# EasyEDA Pro project KDP.epro

# Schematic Schematic
Board Name: Development Platform; Create Date: 2026-08-31; Page Name: P1; Project Name: KDP; Schematic Name: Schematic; Update Date: 2026-09-18; Company: EasyEDA.com; Page Size: A4; Version: V1.0
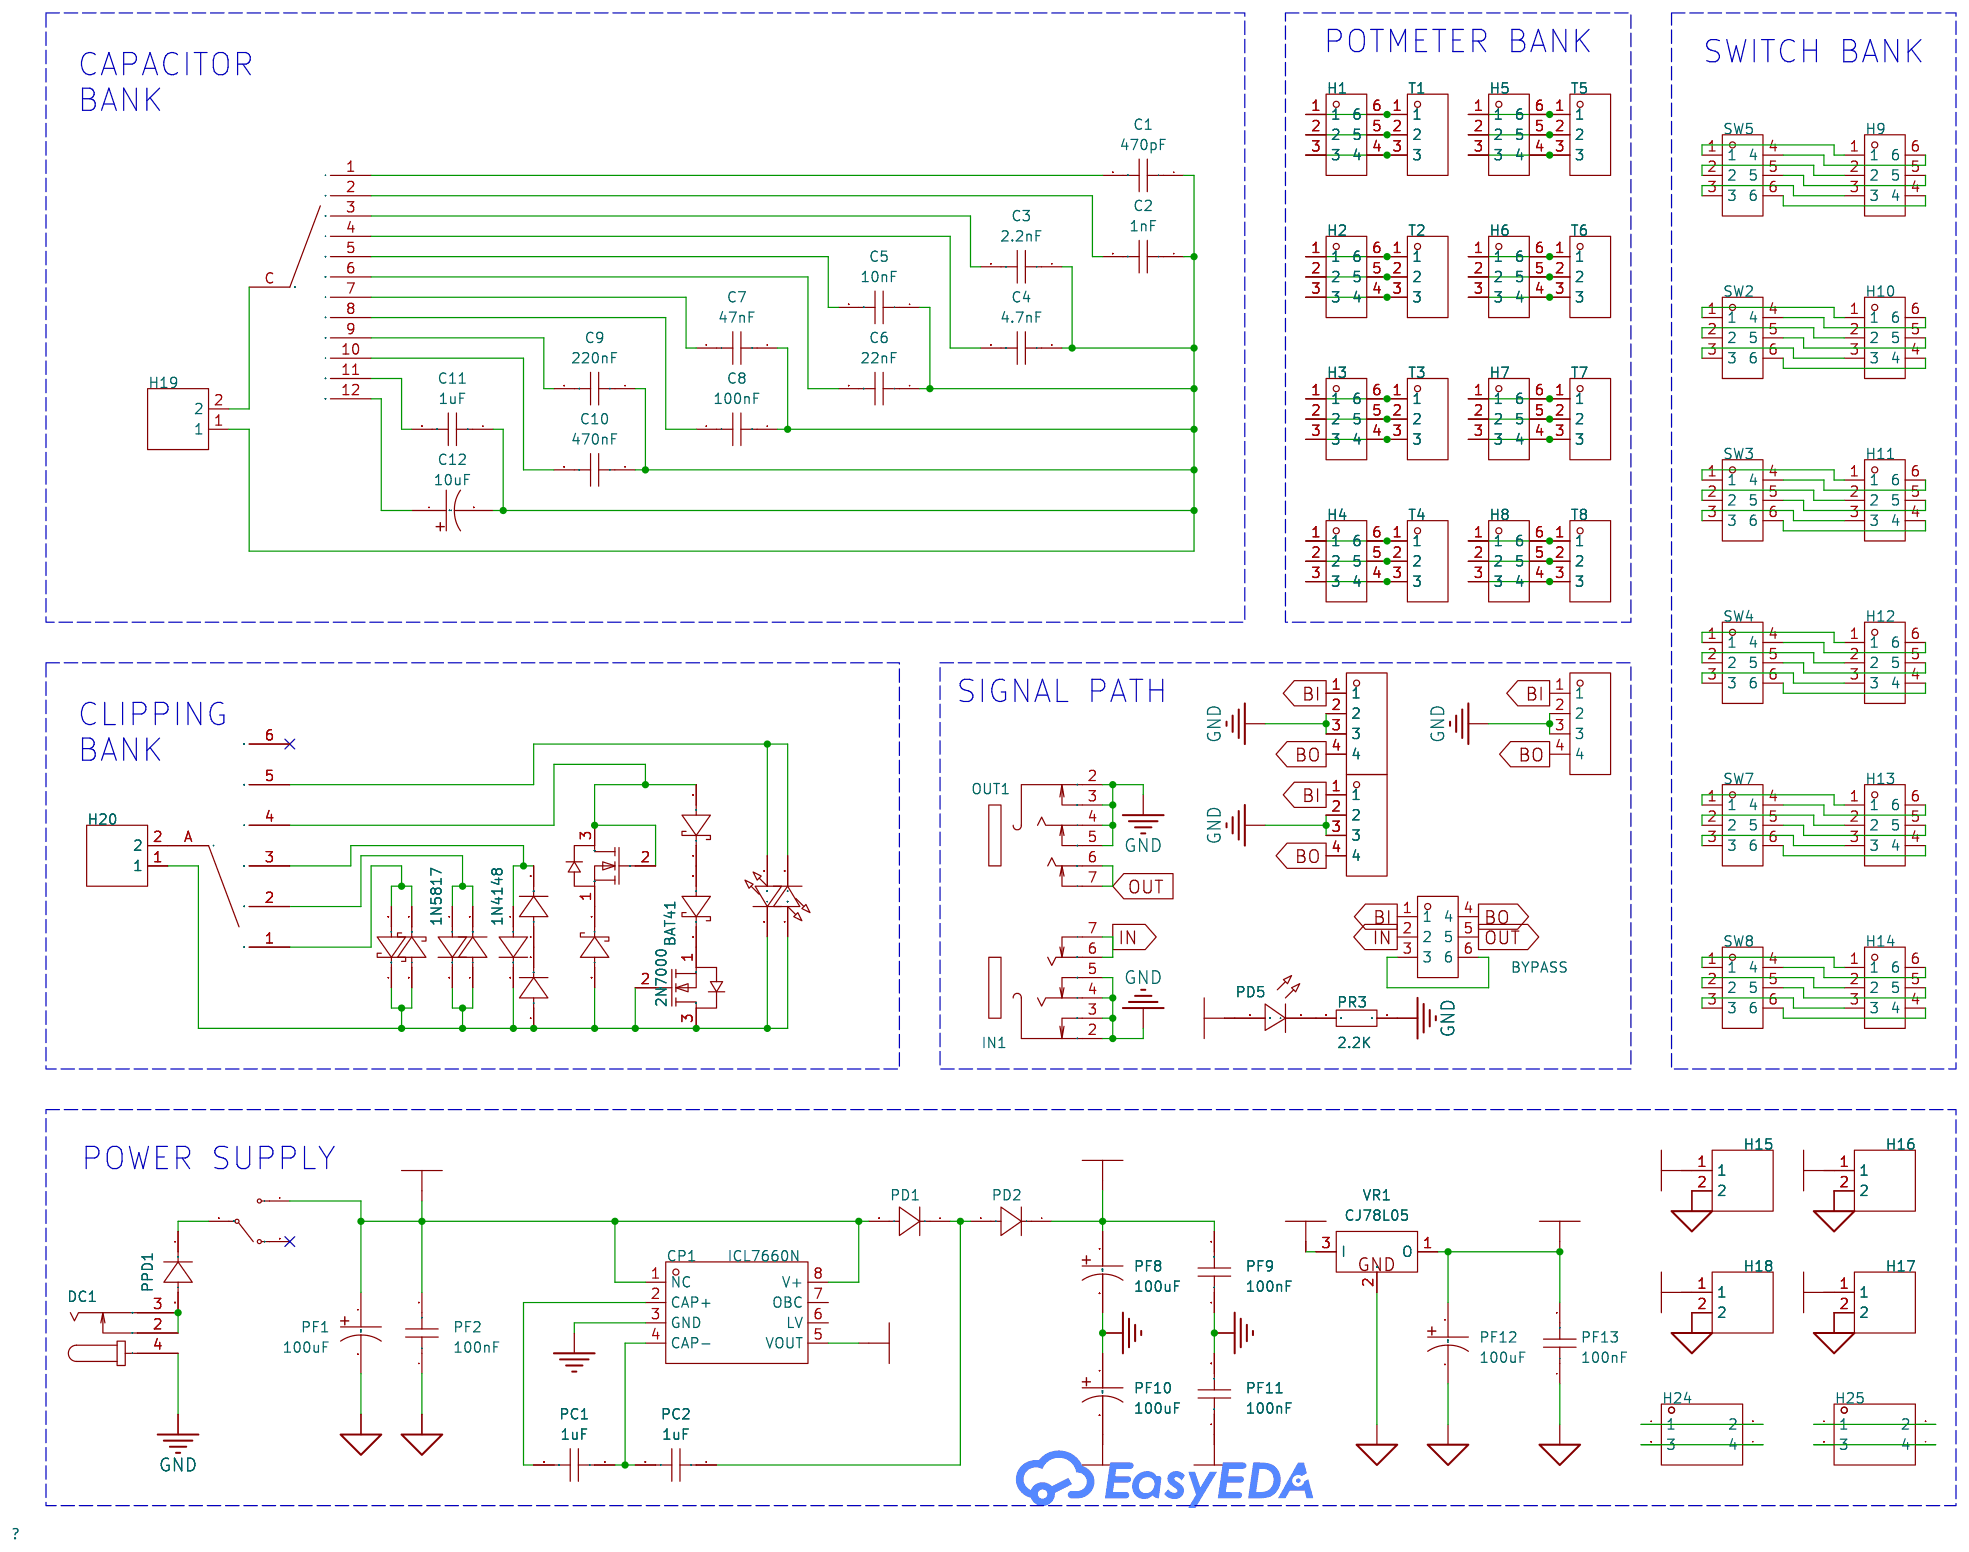
[diagram p0: schematic sheet]

## Parts
BYPASS  ATTACK  [SW-TH_2MD1T1B1M1QES-5]
C1  470pF  [CAP-TH_L4.8-W2.3-P5.08-D0.65]
C2  1nF  [CAP-TH_L4.8-W2.3-P5.08-D0.65]
C3  2.2nF  [CAP-TH_L4.8-W2.3-P5.08-D0.65]
C4  4.7nF  [CAP-TH_L4.8-W2.3-P5.08-D0.65]
C5  10nF  [CAP-TH_L4.8-W2.3-P5.08-D0.65]
C6  22nF  [CAP-TH_L4.8-W2.3-P5.08-D0.65]
C7  47nF  [CAP-TH_L4.8-W2.3-P5.08-D0.65]
C8  100nF  [CAP-TH_L4.8-W2.3-P5.08-D0.65]
C9  220nF  [CAP-TH_L4.8-W2.3-P5.08-D0.65]
C10  470nF  [CAP-TH_L4.8-W2.3-P5.08-D0.65]
C11  1uF  [CAP-TH_L4.8-W2.3-P5.08-D0.65]
C12  10uF  [CAP-TH_BD5.0-P2.00-D0.8-FD]
C_SUB  A30303RNCQ  [SW-TH_15P-BD26.2_A30303RNCQ]
CP1  ICL7660N  [DIP-8_L9.4-W6.4-P2.54-LS9.1-BL]
D1  1N4148  [DO-35_BD2.2-L4.0-D0.50_1N4148]
D2  1N4148  [DO-35_BD2.2-L4.0-D0.50_1N4148]
D3  1N4148  [DO-35_BD2.2-L4.0-D0.50_1N4148]
D4  1N4148  [DO-35_BD2.2-L4.0-D0.50_1N4148]
D5  1N4148  [DO-35_BD2.2-L4.0-D0.50_1N4148]
D6  BAT41  [DO-35_BD1.7-L3.8-P7.8-D0.5-FD]
D7  BAT41  [DO-35_BD1.7-L3.8-P7.8-D0.5-FD]
D8  BAT41  [DO-35_BD1.7-L3.8-P7.8-D0.5-FD]
D-SUB  D-SUB  [SW-TH_15P-BD26.2_A30303RNCQ]
DC1  HX DC005  [DC-IN-TH_HANXIA_HX-DC005-QT]
H1  DS1001-01-06BT1NSF6X-JKB  [DIP-6_L7.6-W10.2-P2.54-LS7.6-BL]
H2  DS1001-01-06BT1NSF6X-JKB  [DIP-6_L7.6-W10.2-P2.54-LS7.6-BL]
H3  DS1001-01-06BT1NSF6X-JKB  [DIP-6_L7.6-W10.2-P2.54-LS7.6-BL]
H4  DS1001-01-06BT1NSF6X-JKB  [DIP-6_L7.6-W10.2-P2.54-LS7.6-BL]
H5  DS1001-01-06BT1NSF6X-JKB  [DIP-6_L7.6-W10.2-P2.54-LS7.6-BL]
H6  DS1001-01-06BT1NSF6X-JKB  [DIP-6_L7.6-W10.2-P2.54-LS7.6-BL]
H7  DS1001-01-06BT1NSF6X-JKB  [DIP-6_L7.6-W10.2-P2.54-LS7.6-BL]
H8  DS1001-01-06BT1NSF6X-JKB  [DIP-6_L7.6-W10.2-P2.54-LS7.6-BL]
H9  DS1001-01-06BT1NSF6X-JKB  [DIP-6_L7.6-W10.2-P2.54-LS7.6-BL]
H10  DS1001-01-06BT1NSF6X-JKB  [DIP-6_L7.6-W10.2-P2.54-LS7.6-BL]
H11  DS1001-01-06BT1NSF6X-JKB  [DIP-6_L7.6-W10.2-P2.54-LS7.6-BL]
H12  DS1001-01-06BT1NSF6X-JKB  [DIP-6_L7.6-W10.2-P2.54-LS7.6-BL]
H13  DS1001-01-06BT1NSF6X-JKB  [DIP-6_L7.6-W10.2-P2.54-LS7.6-BL]
H14  DS1001-01-06BT1NSF6X-JKB  [DIP-6_L7.6-W10.2-P2.54-LS7.6-BL]
H15  -  [HDR-TH_2P-P2.54-V-M-1]
H16  -  [HDR-TH_2P-P2.54-V-M-1]
H17  -  [HDR-TH_2P-P2.54-V-M-1]
H18  -  [HDR-TH_2P-P2.54-V-M-1]
H19  -  [HDR-TH_2P-P2.54-V-M-1]
H20  -  [HDR-TH_2P-P2.54-V-M-1]
H21  -  [HDR-TH_4P-P2.54-V-F]
H22  -  [HDR-TH_4P-P2.54-V-F]
H23  -  [HDR-TH_4P-P2.54-V-F]
H24  -  [HDR-TH_4P-P2.54-V-F-R2-C2-S2.54]
H25  -  [HDR-TH_4P-P2.54-V-F-R2-C2-S2.54]
IN1  INPUT  [AUDIO-TH_PJ-609BA]
OUT1  OUTPUT  [AUDIO-TH_PJ-609BA]
PC1  1uF  [CAP-TH_L4.8-W2.3-P5.08-D0.65]
PC2  1uF  [CAP-TH_L4.8-W2.3-P5.08-D0.65]
PD1  -  [DO-41_BD2.4-L4.7-P8.70-D0.9-RD]
PD2  -  [DO-41_BD2.4-L4.7-P8.70-D0.9-RD]
PD5  -  [LED-TH_BD3.0-P2.54-FD]
PD6  -  [LED-TH_BD3.0-P2.54-FD]
PD7  -  [LED-TH_BD3.0-P2.54-FD]
PF1  100uF  [CAP-TH_BD5.0-P2.00-D0.8-FD]
PF2  100nF  [CAP-TH_L4.8-W2.3-P5.08-D0.65]
PF8  100uF  [CAP-TH_BD5.0-P2.00-D0.8-FD]
PF9  100nF  [CAP-TH_L4.8-W2.3-P5.08-D0.65]
PF10  100uF  [CAP-TH_BD5.0-P2.00-D0.8-FD]
PF11  100nF  [CAP-TH_L4.8-W2.3-P5.08-D0.65]
PF12  100uF  [CAP-TH_BD5.0-P2.00-D0.8-FD]
PF13  100nF  [CAP-TH_L4.8-W2.3-P5.08-D0.65]
POWER  2MS1T1B1M2QES-5  [SW-TH_2MS1T1B1M2QES-5]
PPD1  -  [DO-41_BD2.4-L4.7-P8.70-D0.9-RD]
PR3  2.2K  [R_AXIAL-0.4]
Q1  2N7000  [TO-92-3_L4.9-W3.7-P1.27-L]
Q2  2N7000  [TO-92-3_L4.9-W3.7-P1.27-L]
SW2  ATTACK  [SW-TH_2MD1T1B1M1QES-5]
SW3  ATTACK  [SW-TH_2MD1T1B1M1QES-5]
SW4  ATTACK  [SW-TH_2MD1T1B1M1QES-5]
SW5  ATTACK  [SW-TH_2MD1T1B1M1QES-5]
SW7  ATTACK  [SW-TH_2MD1T1B1M1QES-5]
SW8  ATTACK  [SW-TH_2MD1T1B1M1QES-5]
T1  DG103-5.0-03P-14-00A(H)  [CONN-TH_DG103-5.0-03P-14-00A]
T2  DG103-5.0-03P-14-00A(H)  [CONN-TH_DG103-5.0-03P-14-00A]
T3  DG103-5.0-03P-14-00A(H)  [CONN-TH_DG103-5.0-03P-14-00A]
T4  DG103-5.0-03P-14-00A(H)  [CONN-TH_DG103-5.0-03P-14-00A]
T5  DG103-5.0-03P-14-00A(H)  [CONN-TH_DG103-5.0-03P-14-00A]
T6  DG103-5.0-03P-14-00A(H)  [CONN-TH_DG103-5.0-03P-14-00A]
T7  DG103-5.0-03P-14-00A(H)  [CONN-TH_DG103-5.0-03P-14-00A]
T8  DG103-5.0-03P-14-00A(H)  [CONN-TH_DG103-5.0-03P-14-00A]
U2  1N5817  [DO-41_BD2.4-L4.7-P8.70-D0.8-RD]
U3  1N5817  [DO-41_BD2.4-L4.7-P8.70-D0.8-RD]
VR1  CJ78L05  [TO-92-3_L4.9-W3.7-P1.27-L]

## Library data of the parts
BYPASS SW2-SW5 SW7 SW8 = 2MD1T1B1M1QES-5: Circuit:DPDT Mechanical Life:30,000 Times Actuator Type:Cylinder knob Pin Style:Solder Mounting Style:Direct Insert Operating Temperature:-40℃~+85℃ Operating Temperature:-40℃~+85℃; LCSC Part Name: 2MD1T1B1M1QES-5  1个螺母 3件套 一个螺母，三件套; Supplier Part: C496170; Manufacturer: Dailywell(德利威); Supplier Footprint: 插件; JLCPCB Part Class: Extended Part; Datasheet: https://atta.szlcsc.com/upload/public/pdf/source/20200324/C496170_954A7394085DEA4CF4EC9443DF401EBE.pdf; Supplier: LCSC; Circuit: DPDT; Mechanical Life: 30,000 Times; Actuator Type: Cylinder knob; Pin Style: Solder; Mounting Style: Direct Insert; Operating Temperature: -40℃~+85℃
C1-C11 PC1 PC2 PF2 PF9 PF11 PF13 = CC1H223ZC1FD3F4D1000: Capacitance: Tolerance:-20%~+80% Tolerance:-20%~+80% Voltage Rated: Temperature Coefficient: Lead Spacing: φD: Body Thickness:; LCSC Part Name: 22nF -20%~+80% 50V; Supplier Part: C377845; Manufacturer: Dersonic(德尔创); Supplier Footprint: 插件,P=5.08mm; JLCPCB Part Class: Extended Part; Datasheet: https://atta.szlcsc.com/upload/public/pdf/source/20200826/C377845_726F8BB569AC1EEBEC50B557181F08CD.pdf; Supplier: LCSC; Tolerance: -20%~+80%
C12 PF1 PF8 PF10 PF12 = 25YXF47MFFC5X11: Capacitance: Tolerance:±20% Tolerance:±20% Rated Voltage: φD: L: Lead Spacing: Ripple Current:150mA@100kHz Equivalent Series Resistance(ESR):900mΩ@100kHz Lifetime @ Temp:5000hrs@105℃; LCSC Part Name: 47uF ±20% 25V; Supplier Part: C216203; Manufacturer: rubycon(红宝石); Supplier Footprint: 插件,D5xL11mm; JLCPCB Part Class: Extended Part; Datasheet: https://atta.szlcsc.com/upload/public/pdf/source/20180502/C216203_7BA1B617964B1F950EF12935B9C2F1BE.pdf; Supplier: LCSC; Tolerance: ±20%; Ripple Current: 150mA@100kHz; Equivalent Series Resistance(ESR): 900mΩ@100kHz; Lifetime @ Temp: 5000hrs@105℃
C_SUB = A30303_2_6: Positions:3 Actuator Type:Flat Termination Style:PC Pin Life:30,000 cycles Voltage Rating (AC):125V Voltage Rating (DC):125V Angle of Throw:30° Number of Decks:1 Number of Poles Per Deck:3 Operating Temperature:-40℃~+80℃ Operating Temperature:-40℃~+80℃; LCSC Part Name: 直角照明锁存按钮开关; Supplier Part: C2817536; Manufacturer: C&K; Supplier Footprint: 插件; JLCPCB Part Class: Extended Part; Datasheet: https://item.szlcsc.com/datasheet/A30303RNCQ/2960824.html; Supplier: LCSC; Positions: 3; Actuator Type: Flat; Termination Style: PC Pin; Life: 30,000 cycles; Voltage Rating (AC): 125V; Voltage Rating (DC): 125V; Angle of Throw: 30°; Number of Decks: 1; Number of Poles Per Deck: 3; Operating Temperature: -40℃~+80℃
CP1 = ICL7660N: Supplier Part: C19193423; Manufacturer: HGSEMI(华冠); Supplier Footprint: DIP-8; JLCPCB Part Class: Extended Part; Datasheet: https://atta.szlcsc.com/upload/public/pdf/source/20231208/A47A2180530992FCCD2558815FF503B1.pdf; Supplier: LCSC
D1-D5 = 1N4148_C7437620: Current - Rectified:150mA Voltage - DC Reverse(Vr):100V Voltage - Forward(Vf@If):1V Reverse Leakage Current (Ir):5uA Reverse Recovery Time (trr):4ns; Supplier Part: C7437620; Manufacturer: XCH(旭昌辉); Supplier Footprint: DO-35; JLCPCB Part Class: Extended Part; Datasheet: https://item.szlcsc.com/datasheet/1N4148/8461774.html; Supplier: LCSC; Current - Rectified: 150mA; Voltage - DC Reverse(Vr): 100V; Voltage - Forward(Vf@If): 1V; Reverse Leakage Current (Ir): 5uA; Reverse Recovery Time (trr): 4ns
D6-D8 = BAT41: Diode Configuration:1 Independent Voltage - Forward(Vf@If):400mV@1mA Voltage - DC Reverse(Vr):100V Current - Rectified:100mA Reverse Leakage Current (Ir):100nA@50V Operating Junction Temperature Range:-65℃~+125℃ Operating Junction Temperature Range:-65℃~+; LCSC Part Name: 电压:100V 电流:100mA; Supplier Part: C2969790; Manufacturer: ST(意法半导体); Supplier Footprint: DO-35; JLCPCB Part Class: Extended Part; Datasheet: https://item.szlcsc.com/datasheet/BAT41/3362254.html; Supplier: LCSC; Diode Configuration: 1 Independent; Voltage - Forward(Vf@If): 400mV@1mA; Voltage - DC Reverse(Vr): 100V; Current - Rectified: 100mA; Reverse Leakage Current (Ir): 100nA@50V; Operating Junction Temperature Range: -65℃~+125℃; Non-Repetitive Peak Forward Surge Current: 750mA
D-SUB = A30303_2P6T
DC1 = HX DC005: Connector Type:DCReceptacle Mounting Style:卧插 Current Rating (Max):1A Voltage Rating (Max):12V Operating Temperature Range:-25℃~+85℃ Operating Temperature Range:-25℃~+85℃; LCSC Part Name: DC插座; Supplier Part: C5184828; Manufacturer: hanxia(韩下); Supplier Footprint: 插件; JLCPCB Part Class: Extended Part; Datasheet: https://atta.szlcsc.com/upload/public/pdf/source/20220930/2CBD4D50F5D14F540E1FF5EAF4848C3F.pdf; Supplier: LCSC; Connector Type: DCReceptacle; Mounting Style: 卧插; Current Rating (Max): 1A; Voltage Rating (Max): 12V; Operating Temperature Range: -25℃~+85℃
H1-H14 = DS1001-01-06BT1NSF6X-JKB: Adaptation Package Type:DIP Pitch:2.54mm Row Spacing:7.62mm Circular Holes/Square Holes:Round Hole Number of Positions:6P Contact Material:Copper alloy Contact Plating:Tin; LCSC Part Name: 间距2.54mm 圆孔 P数:6P; Supplier Part: C7495222; Manufacturer: CONNFLY; Supplier Footprint: DIP,P=2.54mm; JLCPCB Part Class: Extended Part; Datasheet: https://item.szlcsc.com/datasheet/DS1001-01-06BT1NSF6X-JKB/8559426.html; Supplier: LCSC; Adaptation Package Type: DIP; Pitch: 2.54mm; Row Spacing: 7.62mm; Circular Holes/Square Holes: Round Hole; Number of Positions: 6P; Contact Material: Copper alloy; Contact Plating: Tin
H15-H20 = HDR-M_2.54_1x2P: Supplier Footprint: Through
H21-H23 = HDR-F_2.54_1x4P: Supplier Footprint: Through
H24 H25 = HDR-F_2.54_2x2: Supplier Footprint: Through
IN1 OUT1 = PJ-609BA: Connector Type:6.35mm耳机座 Current Rating (Max):1A Voltage Rating (Max):50V Operating Temperature Range:-20℃~+70℃ Operating Temperature Range:-20℃~+70℃; LCSC Part Name: 6.35mm耳机座 三件套; Supplier Part: C309277; Manufacturer: HOOYA(皓宇电子); Supplier Footprint: 插件; JLCPCB Part Class: Extended Part; Datasheet: https://atta.szlcsc.com/upload/public/pdf/source/20181226/C309277_C177448557926C8715B33BA7FB29AA52.pdf; Supplier: LCSC; Connector Type: 6.35mm耳机座; Current Rating (Max): 1A; Voltage Rating (Max): 50V; Operating Temperature Range: -20℃~+70℃
PD1 PD2 PPD1 = 1N4007: Supplier Footprint: DO-41
PD5-PD7 = LED_TH-R_3mm: Supplier Footprint: Through
POWER = 2MS1T1B1M2QES-5: Circuit:Single Pole Double Throw (SPDT) Mechanical Life:30,000 Times Actuator Type:Cylinder knob Pin Style:PCPin Mounting Style:Direct Insert Operating Temperature:-40℃~+85℃ Operating Temperature:-40℃~+85℃; LCSC Part Name: 2M系列 钮子开关 摇头开关 3件套 三件套; Supplier Part: C908280; Manufacturer: Dailywell(德利威); Supplier Footprint: 插件; JLCPCB Part Class: Extended Part; Datasheet: https://atta.szlcsc.com/upload/public/pdf/source/20200324/C496170_954A7394085DEA4CF4EC9443DF401EBE.pdf; Supplier: LCSC; Circuit: Single Pole Double Throw (SPDT); Mechanical Life: 30,000 Times; Actuator Type: Cylinder knob; Pin Style: PCPin; Mounting Style: Direct Insert; Operating Temperature: -40℃~+85℃
PR3 = Res_AXIAL-1/4W: Supplier Footprint: Through
Q1 Q2 = 2N7000: Type:1 N-Channel Drain Source Voltage (Vdss): Continuous Drain Current (Id): Drain Source On Resistance (RDS(on)@Vgs,Id):5Ω@10V,500mA Power Dissipation (Pd): Gate Threshold Voltage (Vgs(th)@Id):3V@1mA; LCSC Part Name: 1个N沟道 耐压:60V 电流:200mA; Supplier Part: C232838; Manufacturer: onsemi(安森美); Supplier Footprint: TO-92-3; JLCPCB Part Class: Extended Part; Datasheet: https://atta.szlcsc.com/upload/public/pdf/source/20221020/6B07E43F0B4B9B39AB447A9A1885F5BD.pdf; Supplier: LCSC; Type: 1 N-Channel; Drain Source On Resistance (RDS(on)@Vgs,Id): 5Ω@10V,500mA; Gate Threshold Voltage (Vgs(th)@Id): 3V@1mA
T1-T8 = DG103-5.0-03P-14-00A(H): Number of Positions or Pins:1x3P Pitch:5mm Color:Green Mounting Type:Through Hole Number of Pins:3P Number of Rows:1 Number of PINs Per Row:3 Screw Specification:M2.5 Current Rating:24A Voltage Rating (Max):250V Wire Gauge - AWG:12~24 Wire Gauge - mm2:2.5; LCSC Part Name: 1x3P 5mm 直插 排数:1 每排P数:3; Supplier Part: C2682795; Manufacturer: DEGSON(高正/高松); Supplier Footprint: 插件,P=5mm; JLCPCB Part Class: Extended Part; Datasheet: https://item.szlcsc.com/datasheet/DG103-5.0-03P-14-00A(H)/2777930.html; Supplier: LCSC; Number of Positions or Pins: 1x3P; Pitch: 5mm; Color: Green; Mounting Type: Through Hole; Number of Pins: 3P; Number of Rows: 1; Number of PINs Per Row: 3; Screw Specification: M2.5; Current Rating: 24A; Voltage Rating (Max): 250V; Wire Gauge - AWG: 12~24; Wire Gauge - mm2: 2.5; Operating Temperature: -40℃~+105℃; Height Above Board: 15.5mm
U2 U3 = 1N5817_C2935162: Diode Configuration:- Forward Voltage (Vf@If):750mV@3A Reverse Voltage (Vr):20V Average Rectified Current (Io):1A Reverse Leakage Current (Ir):500uA@20V; LCSC Part Name: 电压:20V 电流:1A; Supplier Part: C2935162; Manufacturer: ST(意法半导体); Supplier Footprint: DO-41; JLCPCB Part Class: Extended Part; Datasheet: https://atta.szlcsc.com/upload/public/pdf/source/20211228/717F2CC0C92F60260D68315CB1F487CC.pdf; Supplier: LCSC; Forward Voltage (Vf@If): 750mV@3A; Reverse Voltage (Vr): 20V; Average Rectified Current (Io): 1A; Reverse Leakage Current (Ir): 500uA@20V
VR1 = CJ78L05_C8608: Output Configuration:Positive Voltage - Supply:30V Output Voltage:5V Output Voltage:5V Output Current:100mA Power Supply Rejection Ratio (PSRR):49dB@(120Hz) Voltage Dropout:1.7V standby current:3.8mA Noise:42uV Features:- Operating Temperature:0℃~+150℃@(T; LCSC Part Name: 5V 100mA 30V; Supplier Part: C8608; Manufacturer: CJ(江苏长电/长晶); Supplier Footprint: TO-92; JLCPCB Part Class: Extended Part; Datasheet: https://item.szlcsc.com/datasheet/CJ78L05/9103.html; Supplier: LCSC; Output Configuration: Positive; Voltage - Supply: 30V; Output Voltage: 5V; Output Current: 100mA; Power Supply Rejection Ratio (PSRR): 49dB@(120Hz); Voltage Dropout: 1.7V; standby current: 3.8mA; Noise: 42uV; Operating Temperature: 0℃~+150℃@(Tj); Output Type: Fixed; Number of Outputs: 1

## Nets
5V: H18.1 PF12.1 PF13.2 VR1.1(O)
+9V: CP1.1(NC) CP1.8(V+) H16.1 PD1.2(A) PD5.1(C) PF1.1 PF2.2 POWER.1 VR1.3(I)
+18V: H15.1 PD2.1(K) PF8.1 PF9.2
-9V: CP1.5(VOUT) H17.1 PF10.2 PF11.1
GND: DC1.4 H21.2 H21.3 H22.2 H22.3 H23.2 H23.3 IN1.2 IN1.3 IN1.4 IN1.5 OUT1.2 OUT1.3 OUT1.4 OUT1.5 PR3.1
PGND: CP1.3(GND) H15.2 H16.2 H17.2 H18.2 PF1.2 PF2.1 PF8.2 PF9.1 PF10.1 PF11.2 PF12.2 PF13.1 VR1.2(GND)
BI: BYPASS.1 H21.1 H22.1 H23.1
BO: BYPASS.4 H21.4 H22.4 H23.4
IN: BYPASS.2 IN1.6 IN1.7
OUT: BYPASS.5 OUT1.6 OUT1.7
$1N1289: H1.1 H1.6 T1.1
$1N1293: H1.2 H1.5 T1.2
$1N1298: H1.3 H1.4 T1.3
$1N1350: H2.3 H2.4 T2.3
$1N1352: H2.2 H2.5 T2.2
$1N1354: H2.1 H2.6 T2.1
$1N1405: H3.3 H3.4 T3.3
$1N1407: H3.2 H3.5 T3.2
$1N1409: H3.1 H3.6 T3.1
$1N1460: H4.3 H4.4 T4.3
$1N1462: H4.2 H4.5 T4.2
$1N1464: H4.1 H4.6 T4.1
$1N1662: H6.2 H6.5 T6.2
$1N1664: H6.3 H6.4 T6.3
$1N1666: H6.1 H6.6 T6.1
$1N1668: H5.3 H5.4 T5.3
$1N1670: H5.2 H5.5 T5.2
$1N1672: H8.2 H8.5 T8.2
$1N1674: H8.3 H8.4 T8.3
$1N1676: H8.1 H8.6 T8.1
$1N1678: H7.3 H7.4 T7.3
$1N1680: H7.2 H7.5 T7.2
$1N1682: H7.1 H7.6 T7.1
$1N1684: H5.1 H5.6 T5.1
$1N2423: PC2.1 PD1.1(K) PD2.2(A)
$1N2425: CP1.4(CAP-) PC1.1 PC2.2
$1N2426: CP1.2(CAP+) PC1.2
$1N4571: H9.6 SW5.4
$1N4578: H9.5 SW5.5
$1N4586: H9.4 SW5.6
$1N4598: H9.1 SW5.1
$1N4609: H9.2 SW5.2
$1N4629: H9.3 SW5.3
$1N4736: H10.6 SW2.4
$1N4741: H10.1 SW2.1
$1N4746: H10.2 SW2.2
$1N4751: H10.3 SW2.3
$1N4756: H10.4 SW2.6
$1N4760: H10.5 SW2.5
$1N4863: H11.6 SW3.4
$1N4868: H11.1 SW3.1
$1N4873: H11.2 SW3.2
$1N4878: H11.3 SW3.3
$1N4883: H11.4 SW3.6
$1N4887: H11.5 SW3.5
$1N4990: H12.6 SW4.4
$1N4995: H12.1 SW4.1
$1N5000: H12.2 SW4.2
$1N5005: H12.3 SW4.3
$1N5010: H12.4 SW4.6
$1N5014: H12.5 SW4.5
$1N5086: DC1.2 DC1.3 PPD1.2(A)
$1N5838: PD5.2(A) PR3.2
$1N14198: POWER.2 PPD1.1(K)
$1N14421: H14.6 SW8.4
$1N14422: H14.5 SW8.5
$1N14423: H14.3 SW8.3
$1N14424: H14.2 SW8.2
$1N14425: H13.5 SW7.5
$1N14426: H13.3 SW7.3
$1N14427: H14.4 SW8.6
$1N14428: H13.2 SW7.2
$1N14429: H13.4 SW7.6
$1N14430: H13.6 SW7.4
$1N14431: H14.1 SW8.1
$1N14432: H13.1 SW7.1
$1N14928: C1.1 C2.1 C3.1 C4.1 C5.1 C6.1 C7.1 C8.1 C9.1 C10.1 C11.1 C12.2 H19.1
$1N14933: C2.2 C_SUB.2
$1N14935: C1.2 C_SUB.1
$1N18358: C4.2 C_SUB.4
$1N18435: C6.2 C_SUB.6
$1N18671: C3.2 C_SUB.3
$1N18693: C5.2 C_SUB.5
$1N19177: C10.2 C_SUB.10(4)
$1N19181: C9.2 C_SUB.9(3)
$1N19188: C11.2 C_SUB.11(5)
$1N19192: C12.1 C_SUB.12(6)
$1N19196: C7.2 C_SUB.7(1)
$1N19222: C8.2 C_SUB.8(2)
$1N19528: C_SUB.C H19.2
$1N35393: D-SUB.1 U2.2(A) U3.1(C)
$1N35579: D4.1(A) D5.2(C)
$1N35618: D1.1(A) D2.2(C) D-SUB.2
$1N35624: D1.2(C) D2.1(A) D3.2(C) D5.1(A) D6.2(A) H20.1 PD6.1(C) PD7.2(A) Q1.2(G) Q1.3(D) U2.1(C) U3.2(A)
$1N35638: D3.1(A) D4.2(C) D-SUB.3
$1N35915: D8.2(A) D-SUB.4 Q2.2(G) Q2.3(D)
$1N35919: D6.1(K) Q2.1(S)
$1N35921: D7.1(K) Q1.1(S)
$1N35923: D7.2(A) D8.1(K)
$1N35947: D-SUB.A H20.2
$1N36077: D-SUB.5 PD6.2(A) PD7.1(C)
$1N47244: H24.1 H24.2
$1N47248: H24.3 H24.4
$1N47253: H25.1 H25.2
$1N47258: H25.3 H25.4
Net-(BYPASS-3): BYPASS.3 BYPASS.6

Not connected (* = marked no-connect by the designer): CP1 6(LV) 7(OBC); D-SUB 6*; POWER 3*

## Notes on the sheet
- POTMETER BANK
- CAPACITOR
  BANK
- SWITCH BANK
- SIGNAL PATH
- CLIPPING
  BANK
- POWER SUPPLY

# Board PCB
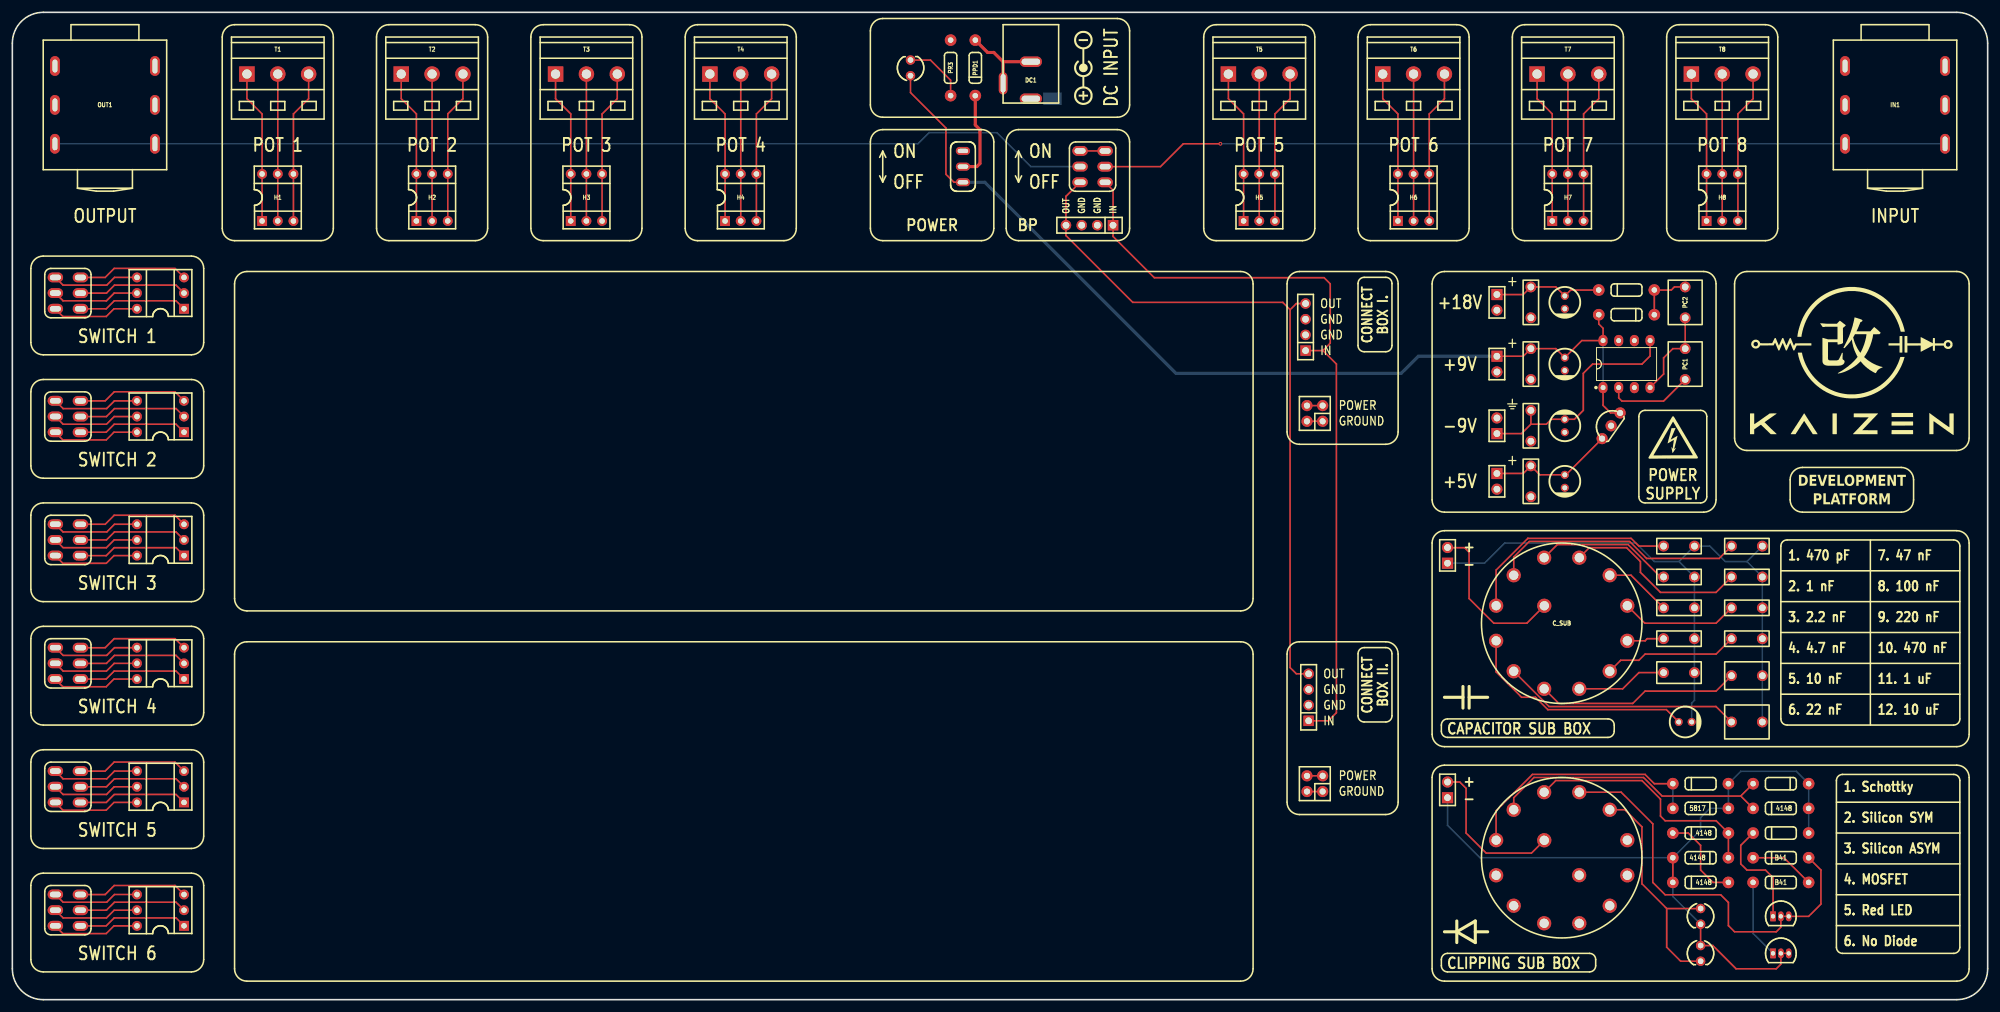
[diagram p1: board, top side]
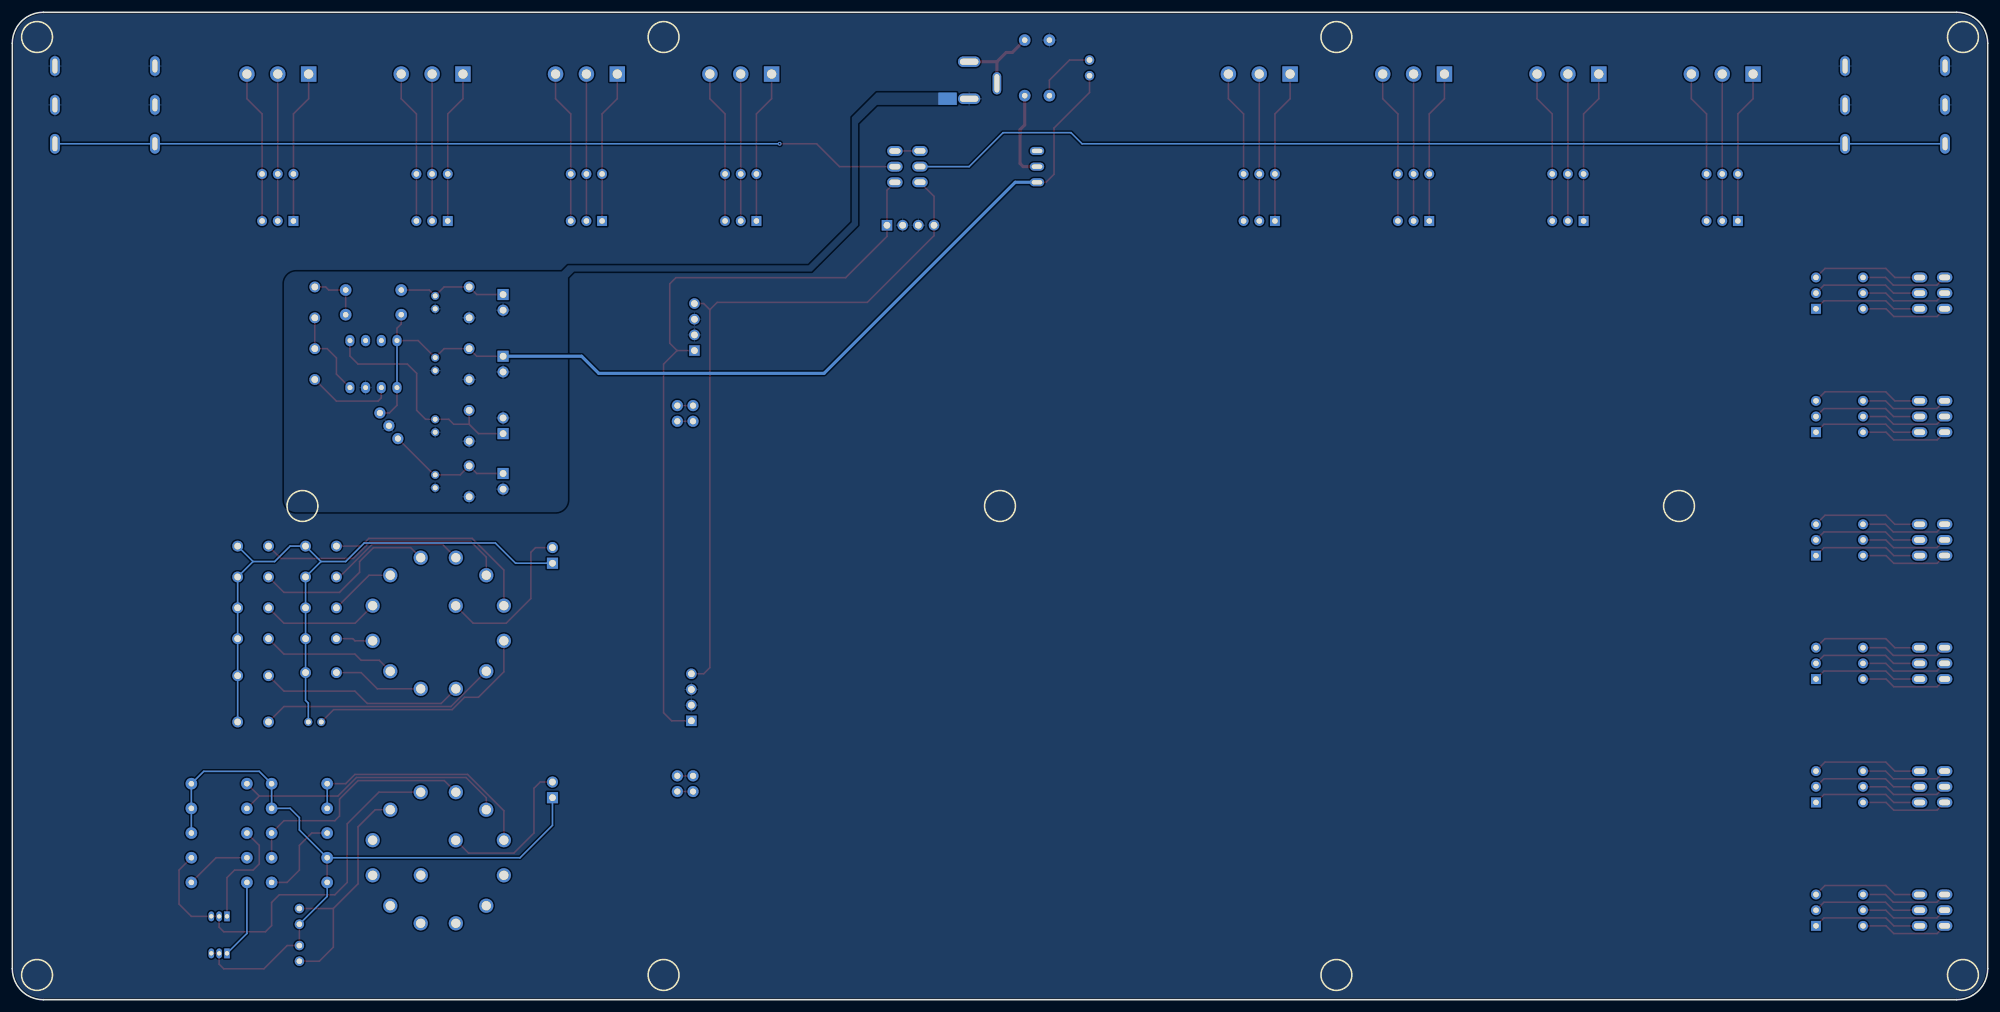
[diagram p2: board, bottom side, seen from below]

Outline 320 x 160 mm; copper layers: Top Layer, Bottom Layer. Coordinates in mm from the lower left corner of the outline.
Outline path: 0,155 0,5 arc(1.46,1.46) 5,0 315,0 arc(318.54,1.46) 320,5 320,155 arc(318.54,158.54) 315,160 5,160 arc(1.46,158.54) 0,155
Stack: Top Layer 0.035mm / Dielectric1 1.51mm FR4 er 4.5 / Bottom Layer 0.035mm

## Design rules (mm)
template: JLCPCB Capability(Two Layers Board)
spacing copperThickness1oz (default): track to track 0.102, other pairs 0.152 to 0.3
spacing copperThickness2oz: track to track 0.203, other pairs 0.152 to 0.3
track width copperThickness1oz (default): min 0.127, default 0.254, max 2.54
track width copperThickness2oz: min 0.203, default 0.254, max 2.54
differential pair differentialPair (default): width min 0.127, default 0.254, max 2.54; gap min 0.152, default 0.152
via viaSize (default): diameter min 0.5, default 0.61, max 10; hole min 0.3, default 0.305, max 6.3

## Placement (name value [footprint] x y rotation side)
BP  ATTACK  [SW-TH_2MD1T1B1M1QES-5]  175 135 0 top
C1  470pF  [CAP-TH_L4.8-W2.3-P5.08-D0.65]  270 73.5 180 top
C2  1nF  [CAP-TH_L4.8-W2.3-P5.08-D0.65]  281 73.5 180 top
C3  2.2nF  [CAP-TH_L4.8-W2.3-P5.08-D0.65]  270 68.5 180 top
C4  4.7nF  [CAP-TH_L4.8-W2.3-P5.08-D0.65]  281 68.5 180 top
C5  10nF  [CAP-TH_L4.8-W2.3-P5.08-D0.65]  270 63.5 180 top
C6  22nF  [CAP-TH_L4.8-W2.3-P5.08-D0.65]  281 63.5 180 top
C7  47nF  [CAP-TH_L4.8-W2.3-P5.08-D0.65]  270 58.5 180 top
C8  100nF  [CAP-TH_L4.8-W2.3-P5.08-D0.65]  281 58.5 180 top
C9  220nF  [CAP-TH_L4.8-W2.3-P5.08-D0.65]  270 53 180 top
C10  470nF  [CAP-TH_L4.8-W2.3-P5.08-D0.65]  281 52.5 180 top
C11  1uF  [CAP-TH_L4.8-W2.3-P5.08-D0.65]  281 45 180 top
C12  10uF  [CAP-TH_BD5.0-P2.00-D0.8-FD]  271 45 0 top
C_SUB  A30303RNCQ  [SW-TH_15P-BD26.2_A30303RNCQ]  251 61 315 top
CP1  ICL7660N  [DIP-8_L9.4-W6.4-P2.54-LS9.1-BL]  261.5 103 0 top
D1  1N4148  [DO-35_BD2.2-L4.0-D0.50_1N4148]  286.5 31 0 top
D2  1N4148  [DO-35_BD2.2-L4.0-D0.50_1N4148]  286.5 35 180 top
D3  1N4148  [DO-35_BD2.2-L4.0-D0.50_1N4148]  273.5 23 180 top
D4  1N4148  [DO-35_BD2.2-L4.0-D0.50_1N4148]  273.5 27 0 top
D5  1N4148  [DO-35_BD2.2-L4.0-D0.50_1N4148]  273.5 19 0 top
D6  BAT41  [DO-35_BD1.7-L3.8-P7.8-D0.5-FD]  286.5 27 0 top
D7  BAT41  [DO-35_BD1.7-L3.8-P7.8-D0.5-FD]  286.5 19 0 top
D8  BAT41  [DO-35_BD1.7-L3.8-P7.8-D0.5-FD]  286.5 23 0 top
D-SUB  D-SUB  [SW-TH_15P-BD26.2_A30303RNCQ#2]  251 23 315 top
DC1  HX DC005  [DC-IN-TH_HANXIA_HX-DC005-QT]  165 149 270 top
H1  DS1001-01-06BT1NSF6X-JKB  [DIP-6_L7.6-W10.2-P2.54-LS7.6-BL]  43 130 0 top
H2  DS1001-01-06BT1NSF6X-JKB  [DIP-6_L7.6-W10.2-P2.54-LS7.6-BL]  68 130 0 top
H3  DS1001-01-06BT1NSF6X-JKB  [DIP-6_L7.6-W10.2-P2.54-LS7.6-BL]  93 130 0 top
H4  DS1001-01-06BT1NSF6X-JKB  [DIP-6_L7.6-W10.2-P2.54-LS7.6-BL]  118 130 0 top
H5  DS1001-01-06BT1NSF6X-JKB  [DIP-6_L7.6-W10.2-P2.54-LS7.6-BL]  202 130 0 top
H6  DS1001-01-06BT1NSF6X-JKB  [DIP-6_L7.6-W10.2-P2.54-LS7.6-BL]  227 130 0 top
H7  DS1001-01-06BT1NSF6X-JKB  [DIP-6_L7.6-W10.2-P2.54-LS7.6-BL]  252 130 0 top
H8  DS1001-01-06BT1NSF6X-JKB  [DIP-6_L7.6-W10.2-P2.54-LS7.6-BL]  277 130 0 top
H9  DS1001-01-06BT1NSF6X-JKB  [DIP-6_L7.6-W10.2-P2.54-LS7.6-BL]  24 94.5 90 top
H10  DS1001-01-06BT1NSF6X-JKB  [DIP-6_L7.6-W10.2-P2.54-LS7.6-BL]  24 114.5 90 top
H11  DS1001-01-06BT1NSF6X-JKB  [DIP-6_L7.6-W10.2-P2.54-LS7.6-BL]  24 74.5 90 top
H12  DS1001-01-06BT1NSF6X-JKB  [DIP-6_L7.6-W10.2-P2.54-LS7.6-BL]  24 54.5 90 top
H13  DS1001-01-06BT1NSF6X-JKB  [DIP-6_L7.6-W10.2-P2.54-LS7.6-BL]  24 34.5 90 top
H14  DS1001-01-06BT1NSF6X-JKB  [DIP-6_L7.6-W10.2-P2.54-LS7.6-BL]  24 14.5 90 top
H15  -  [HDR-TH_2P-P2.54-V-M-1]  240.5 113 270 top
H16  -  [HDR-TH_2P-P2.54-V-M-1]  240.5 103 270 top
H17  -  [HDR-TH_2P-P2.54-V-M-1]  240.5 93 90 top
H18  -  [HDR-TH_2P-P2.54-V-M-1]  240.5 84 270 top
H19  -  [HDR-TH_2P-P2.54-V-M-1]  232.5 72 90 top
H20  -  [HDR-TH_2P-P2.54-V-M-1]  232.5 34 90 top
H21  -  [HDR-TH_4P-P2.54-V-F]  174.5 125.5 180 top
H22  -  [HDR-TH_4P-P2.54-V-F]  209.5 109 90 top
H23  -  [HDR-TH_4P-P2.54-V-F]  210 49 90 top
H24  -  [HDR-TH_4P-P2.54-V-F-R2-C2-S2.54]  211 35 90 top
H25  -  [HDR-TH_4P-P2.54-V-F-R2-C2-S2.54]  211 95 90 top
IN1  INPUT  [AUDIO-TH_PJ-609BA]  305 145 270 top
NOREF  -  [Pad_e1095]  168.5 146 0 top
OUT1  OUTPUT  [AUDIO-TH_PJ-609BA]  15 145 270 top
PC1  1uF  [CAP-TH_L4.8-W2.3-P5.08-D0.65]  271 103 270 top
PC2  1uF  [CAP-TH_L4.8-W2.3-P5.08-D0.65]  271 113 270 top
PD1  -  [DO-41_BD2.4-L4.7-P8.70-D0.9-RD]  261.5 111 180 top
PD2  -  [DO-41_BD2.4-L4.7-P8.70-D0.9-RD]  261.5 115 0 top
PD5  -  [LED-TH_BD3.0-P2.54-FD]  145.5 151 90 bottom
PD6  -  [LED-TH_BD3.0-P2.54-FD]  273.5 7.5 270 bottom
PD7  -  [LED-TH_BD3.0-P2.54-FD]  273.5 13.5 270 bottom
PF1  100uF  [CAP-TH_BD5.0-P2.00-D0.8-FD]  251.5 103 270 top
PF2  100nF  [CAP-TH_L4.8-W2.3-P5.08-D0.65]  246 103 90 top
PF8  100uF  [CAP-TH_BD5.0-P2.00-D0.8-FD]  251.5 113 270 top
PF9  100nF  [CAP-TH_L4.8-W2.3-P5.08-D0.65]  246 113 90 top
PF10  100uF  [CAP-TH_BD5.0-P2.00-D0.8-FD]  251.5 93 90 top
PF11  100nF  [CAP-TH_L4.8-W2.3-P5.08-D0.65]  246 93 270 top
PF12  100uF  [CAP-TH_BD5.0-P2.00-D0.8-FD]  251.5 84 270 top
PF13  100nF  [CAP-TH_L4.8-W2.3-P5.08-D0.65]  246 84 90 top
POWER  2MS1T1B1M2QES-5  [SW-TH_2MS1T1B1M2QES-5]  154 135 0 top
PPD1  -  [DO-41_BD2.4-L4.7-P8.70-D0.9-RD]  156 151 90 top
PR3  2.2K  [R_AXIAL-0.4]  152 151 270 top
Q1  2N7000  [TO-92-3_L4.9-W3.7-P1.27-L#2]  286.5 7.5 0 top
Q2  2N7000  [TO-92-3_L4.9-W3.7-P1.27-L#2]  286.5 13.5 0 top
SW2  ATTACK  [SW-TH_2MD1T1B1M1QES-5]  9 114.5 0 top
SW3  ATTACK  [SW-TH_2MD1T1B1M1QES-5]  9 74.5 0 top
SW4  ATTACK  [SW-TH_2MD1T1B1M1QES-5]  9 54.5 0 top
SW5  ATTACK  [SW-TH_2MD1T1B1M1QES-5]  9 94.5 0 top
SW7  ATTACK  [SW-TH_2MD1T1B1M1QES-5]  9 34.5 0 top
SW8  ATTACK  [SW-TH_2MD1T1B1M1QES-5]  9 14.5 0 top
T1  DG103-5.0-03P-14-00A(H)  [CONN-TH_DG103-5.0-03P-14-00A]  43 150 0 top
T2  DG103-5.0-03P-14-00A(H)  [CONN-TH_DG103-5.0-03P-14-00A]  68 150 0 top
T3  DG103-5.0-03P-14-00A(H)  [CONN-TH_DG103-5.0-03P-14-00A]  93 150 0 top
T4  DG103-5.0-03P-14-00A(H)  [CONN-TH_DG103-5.0-03P-14-00A]  118 150 0 top
T5  DG103-5.0-03P-14-00A(H)  [CONN-TH_DG103-5.0-03P-14-00A]  202 150 0 top
T6  DG103-5.0-03P-14-00A(H)  [CONN-TH_DG103-5.0-03P-14-00A]  227 150 0 top
T7  DG103-5.0-03P-14-00A(H)  [CONN-TH_DG103-5.0-03P-14-00A]  252 150 0 top
T8  DG103-5.0-03P-14-00A(H)  [CONN-TH_DG103-5.0-03P-14-00A]  277 150 0 top
U2  1N5817  [DO-41_BD2.4-L4.7-P8.70-D0.8-RD]  273.5 31 180 top
U3  1N5817  [DO-41_BD2.4-L4.7-P8.70-D0.8-RD]  273.5 35 0 top
VR1  CJ78L05  [TO-92-3_L4.9-W3.7-P1.27-L]  259 93 55 top

## Footprints (pads in the part's own frame, mm; a bottom-side part is the same pattern mirrored in y, then rotated)
AUDIO-TH_PJ-609BA
  oval 3.2x1.6 hole 2.1x0.8: 2(-6.3,-8.1) 4(0,-8.1) 6(6.3,-8.1)
  oval 3.2x1.6 hole 2.4x0.8: 3(-6.3,8.1) 5(0,8.1) 7(6.3,8.1)
CAP-TH_BD5.0-P2.00-D0.8-FD
  round 1.3 hole 0.8: 1(-1.05,0) 2(1.05,0)
CAP-TH_L4.8-W2.3-P5.08-D0.65
  round 1.75 hole 1.1: 1(-2.5,0) 2(2.5,0)
CONN-TH_DG103-5.0-03P-14-00A
  rect 2.5x2.5 hole 1.5: 1(-5,0)
  round 2.5 hole 1.5: 2(0,0) 3(5,0)
DC-IN-TH_HANXIA_HX-DC005-QT
  oval 3.6x1.4 hole 3x0.8: 2(0.5,-4.5)
  oval 1.7x3.6 hole 1x3: 3(-3,0) 4(3,-0.001)
DIP-6_L7.6-W10.2-P2.54-LS7.6-BL
  rect 1.6x1.6 hole 0.9: 1(-2.54,-3.81)
  round 1.6 hole 0.9: 2(0,-3.81) 3(2.54,-3.81) 4(2.54,3.81) 5(0,3.81) 6(-2.54,3.81)
DIP-8_L9.4-W6.4-P2.54-LS9.1-BL
  oval 1.46x1.825 hole 0.8: 1(-3.81,-3.81) 2(-1.27,-3.81) 3(1.27,-3.81) 4(3.81,-3.81) 5(3.81,3.81) 6(1.27,3.81) 7(-1.27,3.81) 8(-3.81,3.81)
DO-35_BD1.7-L3.8-P7.8-D0.5-FD
  round 1.879 hole 0.899: 1(-4.5,0) 2(4.5,0)
DO-35_BD2.2-L4.0-D0.50_1N4148
  round 1.879 hole 0.899: 1(-4.5,0) 2(4.5,0)
DO-41_BD2.4-L4.7-P8.70-D0.8-RD
  round 1.879 hole 0.899: 1(-4.5,0) 2(4.5,0)
DO-41_BD2.4-L4.7-P8.70-D0.9-RD
  round 1.879 hole 0.899: 1(-4.5,0) 2(4.5,0)
HDR-TH_2P-P2.54-V-M-1
  rect 1.8x1.8 hole 1.1: 1(-1.27,0)
  round 1.8 hole 1.1: 2(1.27,0)
HDR-TH_4P-P2.54-V-F
  rect 1.7x1.7 hole 1.1: 1(-3.81,0)
  round 1.7 hole 1.1: 2(-1.27,0) 3(1.27,0) 4(3.81,0)
HDR-TH_4P-P2.54-V-F-R2-C2-S2.54
  round 1.8 hole 1: 1(-1.27,-1.27) 2(-1.27,1.27) 3(1.27,-1.27) 4(1.27,1.27)
LED-TH_BD3.0-P2.54-FD
  round 1.524 hole 0.914: 1(-1.27,0) 2(1.27,0)
Pad_e1095
  rect 3x2 smd far side: TP1(0,0)
R_AXIAL-0.4
  round 1.879 hole 0.899: 1(-4.5,0) 2(4.5,0)
SW-TH_2MD1T1B1M1QES-5
  oval 2.5x1.6 hole 1.8x0.9: 1(2.03,-2.545) 2(2.03,-0.005) 3(2.03,2.535) 4(-2.03,-2.535) 5(-2.03,0.005) 6(-2.03,2.545)
SW-TH_2MS1T1B1M2QES-5
  oval 2.3x1.3 hole 1.7x0.7: 1(0,-2.54) 2(0,0) 3(0,2.54)
SW-TH_15P-BD26.2_A30303RNCQ
  round 2.3 hole 1.5: 1(-9.527,-5.5) 2(-11,0) 3(-9.527,5.5) 4(-5.5,9.527) 5(0,11) 6(5.5,9.527) 7(9.527,5.5) 8(11,0) 9(9.527,-5.5) 10(5.5,-9.527) 11(0,-11) 12(-5.5,-9.527) C(-4,0)
SW-TH_15P-BD26.2_A30303RNCQ#2
  round 2.3 hole 1.5: 1(-9.527,-5.5) 2(-11,0) 3(-9.527,5.5) 4(-5.5,9.527) 5(0,11) 6(5.5,9.527) 7(9.527,5.5) 8(11,0) 9(9.527,-5.5) 10(5.5,-9.527) 11(0,-11) 12(-5.5,-9.527) A(-4,0) C(4,0)
TO-92-3_L4.9-W3.7-P1.27-L
  round 1.8 hole 1: 1(-2.54,0) 2(0,0) 3(2.54,0)
TO-92-3_L4.9-W3.7-P1.27-L#2
  rect 0.9x1.6 hole 0.7: 1(-1.27,0)
  oval 0.9x1.6 hole 0.7: 2(0,0) 3(1.27,0)

## Nets
As in the schematic, except:
PGND: CP1.3 H15.2 H16.2 H17.2 H18.2 NOREF.TP1 PF1.2 PF2.1 PF8.2 PF9.1 PF10.1 PF11.2 PF12.2 PF13.1 VR1.2
BI: BP.1 H21.1 H22.1 H23.1
BO: BP.4 H21.4 H22.4 H23.4
IN: BP.2 IN1.6 IN1.7
OUT: BP.5 OUT1.6 OUT1.7
$1N5079: BP.3 BP.6

Pads without a net: CP1 6 7; D-SUB 6 7 8 9 10 11 12 C; POWER 3

## Via types
v1: diameter 0.61, hole 0.305, Top Layer to Bottom Layer, 1 via

## Routing (per net, layer and track width the routed paths; a pad name or vN(x,y) marks a point on that pad's centre or on a via; arc(x,y) is an arc through that point)
5V: length 20.6
  Top Layer w0.254: H18.1 244.77,85.27 PF13.2 247.45,85.05 PF12.1 251.67,85.05 VR1.1
+9V: length 159.8
  Top Layer w0.254: CP1.1 257.69,96.31 258.92,95.08 VR1.3 ; H16.1 244.77,104.27 PF2.2 250.05,105.5 PF1.1 254.26,106.81 CP1.8 257.69,108.81 257,109.5 PD1.2 ; PD5.1 145.5,147 151.25,141.25 151.25,133.75 152.54,132.46 POWER.1
  Bottom Layer w0.254: CP1.8 CP1.1
  Bottom Layer w0.5: H16.1 227.77,104.27 225,101.5 188.5,101.5 157.54,132.46 POWER.1
+18V: length 18
  Top Layer w0.254: H15.1 244.77,114.27 PF9.2 250.05,115.5 PF8.1 252.45,115 PD2.1
-9V: length 38.3
  Top Layer w0.254: 246,93.25 248.5,93.25 249.3,94.05 PF10.2 253.05,94.05 254.5,95.5 254.5,101.5 256,103 264,103 265.31,104.31 CP1.5 ; 246,93.25 244.48,91.73 H17.1 ; 246,93.25 PF11.1
BI: length 126.4
  Top Layer w0.254: 212.31,105.19 214.5,103 214.5,46.5 213.19,45.19 H23.1 ; 212.31,105.19 213.5,106.38 213.5,116 212.5,117 185,117 178.31,123.69 H21.1 178.31,131.18 BP.1 ; 212.31,105.19 H22.1
BO: length 115.2
  Top Layer w0.254: 207,111.81 205.81,113 181.5,113 170.69,123.81 H21.4 170.69,130.19 BP.4 ; 207,111.81 208,112.81 H22.4 ; 207,111.81 207,53.81 208,52.81 H23.4
IN: length 137.6
  Top Layer w0.254: v1(195.7,138.7) 189.7,138.7 186,135 BP.2
  Bottom Layer w0.254: IN1.7 IN1.6 v1(195.7,138.7)
OUT: length 169.1
  Bottom Layer w0.254: OUT1.6 OUT1.7 146.7,138.7 148.5,140.5 159.5,140.5 165,135 172.97,135 BP.5
$1N1289: length 24.8
  Top Layer w0.254: T1.1 38,146 40.46,143.54 H1.6 H1.1
$1N1293: length 23.8
  Top Layer w0.254: H1.2 H1.5 T1.2
$1N1298: length 24.8
  Top Layer w0.254: T1.3 48,146 45.54,143.54 H1.4 H1.3
$1N1350: length 24.8
  Top Layer w0.254: H2.3 H2.4 70.54,143.54 73,146 T2.3
$1N1352: length 23.8
  Top Layer w0.254: T2.2 H2.5 H2.2
$1N1354: length 24.8
  Top Layer w0.254: H2.1 H2.6 65.46,143.54 63,146 T2.1
$1N1405: length 24.8
  Top Layer w0.254: T3.3 98,146 95.54,143.54 H3.4 H3.3
$1N1407: length 23.8
  Top Layer w0.254: T3.2 H3.5 H3.2
$1N1409: length 24.8
  Top Layer w0.254: T3.1 88,146 90.46,143.54 H3.6 H3.1
$1N1460: length 24.8
  Top Layer w0.254: T4.3 123,146 120.54,143.54 H4.4 H4.3
$1N1462: length 23.8
  Top Layer w0.254: T4.2 H4.5 H4.2
$1N1464: length 24.8
  Top Layer w0.254: T4.1 113,146 115.46,143.54 H4.6 H4.1
$1N1662: length 23.8
  Top Layer w0.254: H6.2 H6.5 T6.2
$1N1664: length 24.8
  Top Layer w0.254: T6.3 232,146 229.54,143.54 H6.4 H6.3
$1N1666: length 24.8
  Top Layer w0.254: T6.1 222,146 224.46,143.54 H6.6 H6.1
$1N1668: length 24.8
  Top Layer w0.254: T5.3 207,146 204.54,143.54 H5.4 H5.3
$1N1670: length 23.8
  Top Layer w0.254: H5.2 H5.5 T5.2
$1N1672: length 23.8
  Top Layer w0.254: H8.2 H8.5 T8.2
$1N1674: length 24.8
  Top Layer w0.254: H8.3 H8.4 279.54,143.54 282,146 T8.3
$1N1676: length 24.8
  Top Layer w0.254: H8.1 H8.6 274.46,143.54 272,146 T8.1
$1N1678: length 24.8
  Top Layer w0.254: T7.3 257,146 254.54,143.54 H7.4 H7.3
$1N1680: length 23.8
  Top Layer w0.254: T7.2 H7.5 H7.2
$1N1682: length 24.8
  Top Layer w0.254: T7.1 247,146 249.46,143.54 H7.6 H7.1
$1N1684: length 24.8
  Top Layer w0.254: H5.1 H5.6 199.46,143.54 197,146 T5.1
$1N2423: length 9.3
  Top Layer w0.254: 266.22,115 PD2.2 ; 266.22,115 268.75,115 269.25,115.5 PC2.1 ; 266.22,115 266,114.78 PD1.1
$1N2425: length 14.8
  Top Layer w0.254: CP1.4 267.5,101.38 267.5,104 269,105.5 PC1.1 PC2.2
$1N2426: length 14.1
  Top Layer w0.254: CP1.2 260.23,97.52 260.75,97 267.5,97 PC1.2
$1N4571: length 14.3
  Top Layer w0.254: 20.15,91.96 16.46,91.96 15.21,90.71 8.19,90.71 6.93,91.97
$1N4578: length 14.3
  Top Layer w0.254: H9.5 16.5,94.5 15.25,93.25 8.22,93.25 SW5.5
$1N4586: length 14.3
  Top Layer w0.254: H9.4 16.54,97.04 15.29,95.79 8.22,95.79 SW5.6
$1N4598: length 17.9
  Top Layer w0.254: SW5.1 15.21,91.95 16.5,93.25 26.52,93.25 H9.1
$1N4609: length 17.9
  Top Layer w0.254: SW5.2 15.25,94.5 16.54,95.79 26.52,95.79 H9.2
$1N4629: length 18
  Top Layer w0.254: SW5.3 15.04,97.03 16.5,98.5 26.35,98.5 H9.3
$1N4736: length 14.3
  Top Layer w0.254: 6.93,111.97 8.19,110.71 15.21,110.71 16.46,111.96 20.15,111.96
$1N4741: length 17.9
  Top Layer w0.254: H10.1 26.52,113.25 16.5,113.25 15.21,111.95 SW2.1
$1N4746: length 17.9
  Top Layer w0.254: H10.2 26.52,115.79 16.54,115.79 15.25,114.5 SW2.2
$1N4751: length 18
  Top Layer w0.254: SW2.3 15.04,117.03 16.5,118.5 26.35,118.5 H10.3
$1N4756: length 14.3
  Top Layer w0.254: SW2.6 8.22,115.79 15.29,115.79 16.54,117.04 H10.4
$1N4760: length 14.3
  Top Layer w0.254: SW2.5 8.22,113.25 15.25,113.25 16.5,114.5 H10.5
$1N4863: length 14.3
  Top Layer w0.254: 6.93,71.97 8.19,70.71 15.21,70.71 16.46,71.96 20.15,71.96
$1N4868: length 17.9
  Top Layer w0.254: SW3.1 15.21,71.95 16.5,73.25 26.52,73.25 H11.1
$1N4873: length 17.9
  Top Layer w0.254: H11.2 26.52,75.79 16.54,75.79 15.25,74.5 SW3.2
$1N4878: length 18
  Top Layer w0.254: H11.3 26.35,78.5 16.5,78.5 15.04,77.03 SW3.3
$1N4883: length 14.3
  Top Layer w0.254: H11.4 16.54,77.04 15.29,75.79 8.22,75.79 SW3.6
$1N4887: length 14.3
  Top Layer w0.254: H11.5 16.5,74.5 15.25,73.25 8.22,73.25 SW3.5
$1N4990: length 14.3
  Top Layer w0.254: 6.93,51.97 8.19,50.71 15.21,50.71 16.46,51.96 20.15,51.96
$1N4995: length 17.9
  Top Layer w0.254: H12.1 26.52,53.25 16.5,53.25 15.21,51.96 SW4.1
$1N5000: length 17.9
  Top Layer w0.254: SW4.2 15.25,54.5 16.54,55.79 26.52,55.79 H12.2
$1N5005: length 18
  Top Layer w0.254: H12.3 26.35,58.5 16.5,58.5 15.04,57.03 SW4.3
$1N5010: length 14.3
  Top Layer w0.254: SW4.6 8.22,55.79 15.29,55.79 16.54,57.04 H12.4
$1N5014: length 14.3
  Top Layer w0.254: H12.5 16.5,54.5 15.25,53.25 8.22,53.25 SW4.5
$1N5079: length 4.1
  Top Layer w0.254: BP.3 177.02,137.55 BP.6
$1N5086: length 13.9
  Top Layer w0.5: DC1.2 160.5,152 ; 160.5,152 159,153.5 158,153.5 PPD1.2 ; 160.5,152 DC1.3
$1N5838: length 10.4
  Top Layer w0.254: PR3.2 152,149 148.73,152.27 PD5.2
$1N14198: length 14.3
  Top Layer w0.5: PPD1.1 156,141.75 156.75,141 156.75,135.5 156.25,135 POWER.2
$1N14421: length 14.3
  Top Layer w0.254: 20.15,11.96 16.46,11.96 15.21,10.71 8.19,10.71 6.93,11.97
$1N14422: length 14.3
  Top Layer w0.254: SW8.5 8.22,13.25 15.25,13.25 16.5,14.5 H14.5
$1N14423: length 18
  Top Layer w0.254: H14.3 26.35,18.5 16.5,18.5 15.04,17.03 SW8.3
$1N14424: length 17.9
  Top Layer w0.254: H14.2 26.52,15.79 16.54,15.79 15.25,14.5 SW8.2
$1N14425: length 14.3
  Top Layer w0.254: H13.5 16.5,34.5 15.25,33.25 8.22,33.25 SW7.5
$1N14426: length 18
  Top Layer w0.254: SW7.3 15.04,37.03 16.5,38.5 26.35,38.5 H13.3
$1N14427: length 14.3
  Top Layer w0.254: H14.4 16.54,17.04 15.29,15.79 8.22,15.79 SW8.6
$1N14428: length 17.9
  Top Layer w0.254: H13.2 26.52,35.79 16.54,35.79 15.25,34.5 SW7.2
$1N14429: length 14.3
  Top Layer w0.254: H13.4 16.54,37.04 15.29,35.79 8.22,35.79 SW7.6
$1N14430: length 14.3
  Top Layer w0.254: 20.15,31.96 16.46,31.96 15.21,30.71 8.19,30.71 6.93,31.97
$1N14431: length 17.9
  Top Layer w0.254: SW8.1 15.21,11.96 16.5,13.25 26.52,13.25 H14.1
$1N14432: length 17.9
  Top Layer w0.254: SW7.1 15.21,31.96 16.5,33.25 26.52,33.25 H13.1
$1N14928: length 111
  Bottom Layer w0.254: H19.1 238.48,70.73 241.75,74 263,74 266,71 270,71 ; 281,71 C4.1 C6.1 C8.1 C10.1 C11.1 ; 281,71 C2.1 ; 281,71 277.5,71 275,73.5 C1.1 270,71 ; 270,71 C3.1 C5.1 C7.1 C9.1 272.5,48.5 272.05,48.05 C12.2
$1N14933: length 41.2
  Top Layer w0.254: C_SUB.2 243.22,71.72 245.75,74.25 262,74.25 264.75,71.5 276.5,71.5 C2.2
$1N14935: length 35.5
  Top Layer w0.254: C1.2 263.5,73.5 262.25,74.75 245.5,74.75 240.38,69.62 240.38,63.85
$1N18358: length 30.4
  Top Layer w0.254: C4.2 276,66 267,66 263.75,69.25 263.75,71 261.5,73.25 255.47,73.25 253.85,71.62
$1N18435: length 19.1
  Top Layer w0.254: C6.2 276,61 264.47,61 261.62,63.85
$1N18671: length 22.4
  Top Layer w0.254: 248.15,71.62 250.28,73.75 261.75,73.75 267,68.5 C3.2
$1N18693: length 10.9
  Top Layer w0.254: C_SUB.5 262.22,68.78 C5.2
$1N19177: length 33.2
  Top Layer w0.254: C10.2 276,50 264.5,50 262.5,48 250.53,48 248.15,50.38
$1N19181: length 14.7
  Top Layer w0.254: 253.85,50.38 260.88,50.38 263.5,53 C9.2
$1N19188: length 38.7
  Top Layer w0.254: C11.2 276,47.5 248.94,47.5 C_SUB.11
$1N19192: length 38
  Top Layer w0.254: 240.38,58.15 240.38,53.12 244.5,49 246.75,49 248.75,47 267.95,47 C12.1
$1N19196: length 6
  Top Layer w0.254: C7.2 264.85,58.5 264.5,58.15 261.62,58.15
$1N19222: length 21.9
  Top Layer w0.254: C8.2 276,56 264.5,56 263.5,55 260.56,55 C_SUB.8
$1N19528: length 26.3
  Top Layer w0.254: C_SUB.C 245.34,61 240,61 236,65 236,72.5 235.25,73.25 232.52,73.25 H19.2
$1N35393: length 40.5
  Top Layer w0.254: U3.1 266,35 264.5,36.5 246.25,36.5 240.38,30.62 240.38,25.85
  Bottom Layer w0.254: U3.1 U2.2
$1N35579: length 14.7
  Top Layer w0.254: D4.1 271.5,27 273.5,25 273.5,21 275.5,19 D5.2
$1N35618: length 47
  Top Layer w0.254: 280,33 D2.2 ; 280,33 267.25,33 264.25,36 246.5,36 243.22,32.72 D-SUB.2 ; 280,33 D1.1
$1N35624: length 117.3
  Top Layer w0.254: PD7.2 PD6.1 275.48,8.77 279.25,5 285.75,5 286.5,5.75 Q1.2 Q1.3 ; D3.2 D5.1
  Bottom Layer w0.254: PD7.2 269,16.73 D5.1 ; D6.2 D1.2 D2.1 289,37 280,37 U3.2 U2.1 275,31 273.5,29.5 273.5,27.5 D3.2 237.75,23 232.5,28.25 H20.1
$1N35638: length 39.8
  Top Layer w0.254: 248.15,33.62 250.03,35.5 264,35.5 267,32.5 267,29.75 267.75,29 276,29 D4.2 D3.1
$1N35915: length 67.5
  Top Layer w0.254: 253.85,33.62 260.62,33.62 265.75,28.5 265.75,19 267.75,17 276.75,17 278,15.75 278,12 279,11 285.75,11 286.5,11.75 Q2.2 Q2.3 291,13.5 293,15.5 293,21 D8.2
$1N35919: length 18.3
  Top Layer w0.254: Q2.1 285.23,19.77 284,21 281,21 280,22 280,25 D6.1
$1N35921: length 12.8
  Bottom Layer w0.254: D7.1 282,10.73 Q1.1
$1N35923: length 10.7
  Top Layer w0.254: D8.1 287,23 D7.2
$1N35947: length 25.6
  Top Layer w0.254: H20.2 234.48,35.27 235.5,34.25 235.5,27 238.75,23.75 246.09,23.75 D-SUB.A
$1N36077: length 39.5
  Top Layer w0.254: PD7.1 268,14.77 ; 268,14.77 264,18.77 264,28 261.22,30.78 D-SUB.5 ; 268,14.77 268,8.5 270.27,6.23 PD6.2
$1N47244: length 2.5
  Top Layer w0.254: H24.1 H24.2
$1N47248: length 2.5
  Top Layer w0.254: H24.4 H24.3
$1N47253: length 2.5
  Top Layer w0.254: H25.1 H25.2
$1N47258: length 2.5
  Top Layer w0.254: H25.4 H25.3

## Copper pours and planes (outline as drawn; the poured copper is in the pictures)
GND on Top Layer: 0,155 0.01,155.34 0.06,155.78 0.15,156.22 0.28,156.65 0.45,157.07 0.65,157.47 0.89,157.85 1.16,158.2 1.46,158.54 1.8,158.84 2.15,159.11 2.53,159.35 2.93,159.55 3.35,159.72 3.78,159.85 4.22,159.94 4.66,159.99 5,160 315,160 315.34,159.99 315.78,159.94 316.22,159.85 316.65,159.72 317.07,159.55 317.47,159.35 317.85,159.11 318.2,158.84 318.54,158.54 318.84,158.2 319.11,157.85 319.35,157.47 319.55,157.07 319.72,156.65 319.85,156.22 319.94,155.78 319.99,155.34 320,155 320,5 319.99,4.66 319.94,4.22 319.85,3.78 319.72,3.35 319.55,2.93 319.35,2.53 319.11,2.15 318.84,1.8 318.54,1.46 318.2,1.16 317.85,0.89 317.47,0.65 317.07,0.45 316.65,0.28 316.22,0.15 315.78,0.06 315.34,0.01 315,0 5,0 4.66,0.01 4.22,0.06 3.78,0.15 3.35,0.28 2.93,0.45 2.53,0.65 2.15,0.89 1.8,1.16 1.46,1.46 1.16,1.8 0.89,2.15 0.65,2.53 0.45,2.93 0.28,3.35 0.15,3.78 0.06,4.22 0.01,4.66 0,5
GND on Bottom Layer: 0,155 0.01,155.34 0.06,155.78 0.15,156.22 0.28,156.65 0.45,157.07 0.65,157.47 0.89,157.85 1.16,158.2 1.46,158.54 1.8,158.84 2.15,159.11 2.53,159.35 2.93,159.55 3.35,159.72 3.78,159.85 4.22,159.94 4.66,159.99 5,160 315,160 315.34,159.99 315.78,159.94 316.22,159.85 316.65,159.72 317.07,159.55 317.47,159.35 317.85,159.11 318.2,158.84 318.54,158.54 318.84,158.2 319.11,157.85 319.35,157.47 319.55,157.07 319.72,156.65 319.85,156.22 319.94,155.78 319.99,155.34 320,155 320,5 319.99,4.66 319.94,4.22 319.85,3.78 319.72,3.35 319.55,2.93 319.35,2.53 319.11,2.15 318.84,1.8 318.54,1.46 318.2,1.16 317.85,0.89 317.47,0.65 317.07,0.45 316.65,0.28 316.22,0.15 315.78,0.06 315.34,0.01 315,0 5,0 4.66,0.01 4.22,0.06 3.78,0.15 3.35,0.28 2.93,0.45 2.53,0.65 2.15,0.89 1.8,1.16 1.46,1.46 1.16,1.8 0.89,2.15 0.65,2.53 0.45,2.93 0.28,3.35 0.15,3.78 0.06,4.22 0.01,4.66 0,5
PGND on Top Layer: 232,79 231.72,79.02 231.44,79.08 231.17,79.18 230.92,79.32 230.69,79.49 230.49,79.69 230.32,79.92 230.18,80.17 230.08,80.44 230.02,80.72 230,81 230,116 230.02,116.28 230.08,116.56 230.18,116.83 230.32,117.08 230.49,117.31 230.69,117.51 230.92,117.68 231.17,117.82 231.44,117.92 231.72,117.98 232,118 274,118 274.28,117.98 274.56,117.92 274.83,117.82 275.08,117.68 275.31,117.51 275.51,117.31 275.68,117.08 275.82,116.83 275.92,116.56 275.98,116.28 276,116 276,81 275.98,80.72 275.92,80.44 275.82,80.17 275.68,79.92 275.51,79.69 275.31,79.49 275.08,79.32 274.83,79.18 274.56,79.08 274.28,79.02 274,79
PGND on Bottom Layer: 184,126 191,119 230,119 231,118 274,118 275.41,117.41 276,116 276,81 275.41,79.59 274,79 232,79 230.59,79.59 230,81 230,117 229,118 190.5,118 183,125.5 183,141.97 179.93,145 167,145 167,147 180,147 184,143

## Text on the board
Top Silkscreen Layer: 5817 | B41 | 4148 | OUT | GND | IN | POWER | GROUND | 1. 470 pF | 2. 1 nF | 3. 2.2 nF | 4. 4.7 nF | 5. 10 nF | 6. 22 nF | 1. Schottky | 2. Silicon SYM | 3. Silicon ASYM | 4. MOSFET | 5. Red LED | 6. No Diode | 7. 47 nF | 8. 100 nF | 9. 220 nF | 10. 470 nF | 11. 1 uF | 12. 10 uF | CONNECT / BOX I. | CONNECT / BOX II. | + | + / - | CAPACITOR SUB BOX | CLIPPING SUB BOX | SUPPLY | ON | OFF | OUTPUT | SWITCH 1 | SWITCH 2 | SWITCH 3 | SWITCH 4 | SWITCH 5 | SWITCH 6 | POT 1 | POT 2 | POT 3 | POT 4 | POT 5 | POT 6 | +18V | +9V | -9V | +5V | POT 7 | POT 8 | INPUT | DC | DEVELOPMENT | PLATFORM
